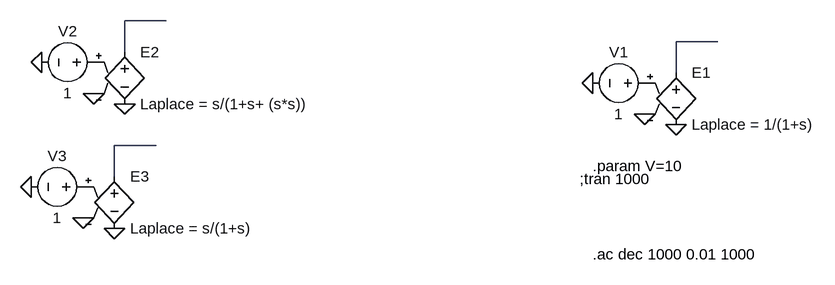
[diagram p0: schematic Draft1.asc]
Draft1.asc, the LTspice schematic file:
Version 4
SHEET 1 880 680
WIRE -640 48 -704 48
WIRE 208 80 144 80
WIRE -704 96 -704 48
WIRE 144 128 144 80
WIRE -656 240 -720 240
WIRE -720 288 -720 240
FLAG 144 208 0
FLAG 96 192 0
FLAG 16 144 0
FLAG -704 176 0
FLAG -752 160 0
FLAG -832 112 0
FLAG -720 368 0
FLAG -768 352 0
FLAG -848 304 0
SYMBOL e 144 112 R0
SYMATTR InstName E1
SYMATTR Value Laplace = 1/(1+s)
SYMBOL voltage 112 144 R90
WINDOW 0 -32 56 VBottom 2
WINDOW 3 32 56 VTop 2
WINDOW 39 0 0 Left 0
SYMATTR InstName V1
SYMATTR Value 1
SYMATTR Value2 AC 1
SYMBOL e -704 80 R0
SYMATTR InstName E2
SYMATTR Value Laplace = s/(1+s+ (s*s))
SYMBOL voltage -736 112 R90
WINDOW 0 -32 56 VBottom 2
WINDOW 3 32 56 VTop 2
WINDOW 39 0 0 Left 0
SYMATTR InstName V2
SYMATTR Value 1
SYMATTR Value2 AC 1
SYMBOL e -720 272 R0
SYMATTR InstName E3
SYMATTR Value Laplace = s/(1+s)
SYMBOL voltage -752 304 R90
WINDOW 0 -32 56 VBottom 2
WINDOW 3 32 56 VTop 2
WINDOW 39 0 0 Left 0
SYMATTR InstName V3
SYMATTR Value 1
SYMATTR Value2 AC 1
TEXT 16 272 Left 2 !.param V=10
TEXT -4 292 Left 2 !;tran 1000
TEXT 16 408 Left 2 !.ac dec 1000 0.01 1000

The netlist it stands for:
* Draft1.asc
E1 N002 0 P001 0 Laplace = 1/(1+s)
V1 P001 0 1 AC 1
E2 N001 0 P002 0 Laplace = s/(1+s+ (s*s))
V2 P002 0 1 AC 1
E3 N003 0 P003 0 Laplace = s/(1+s)
V3 P003 0 1 AC 1
.param V=10
;tran 1000
.ac dec 1000 0.01 1000
.backanno
.end